# Altium schematic sheet Peripherals.SchDoc: Sensors & Peripherals Interfaces
size A2; SheetNumber: 3; SheetTotal: 5
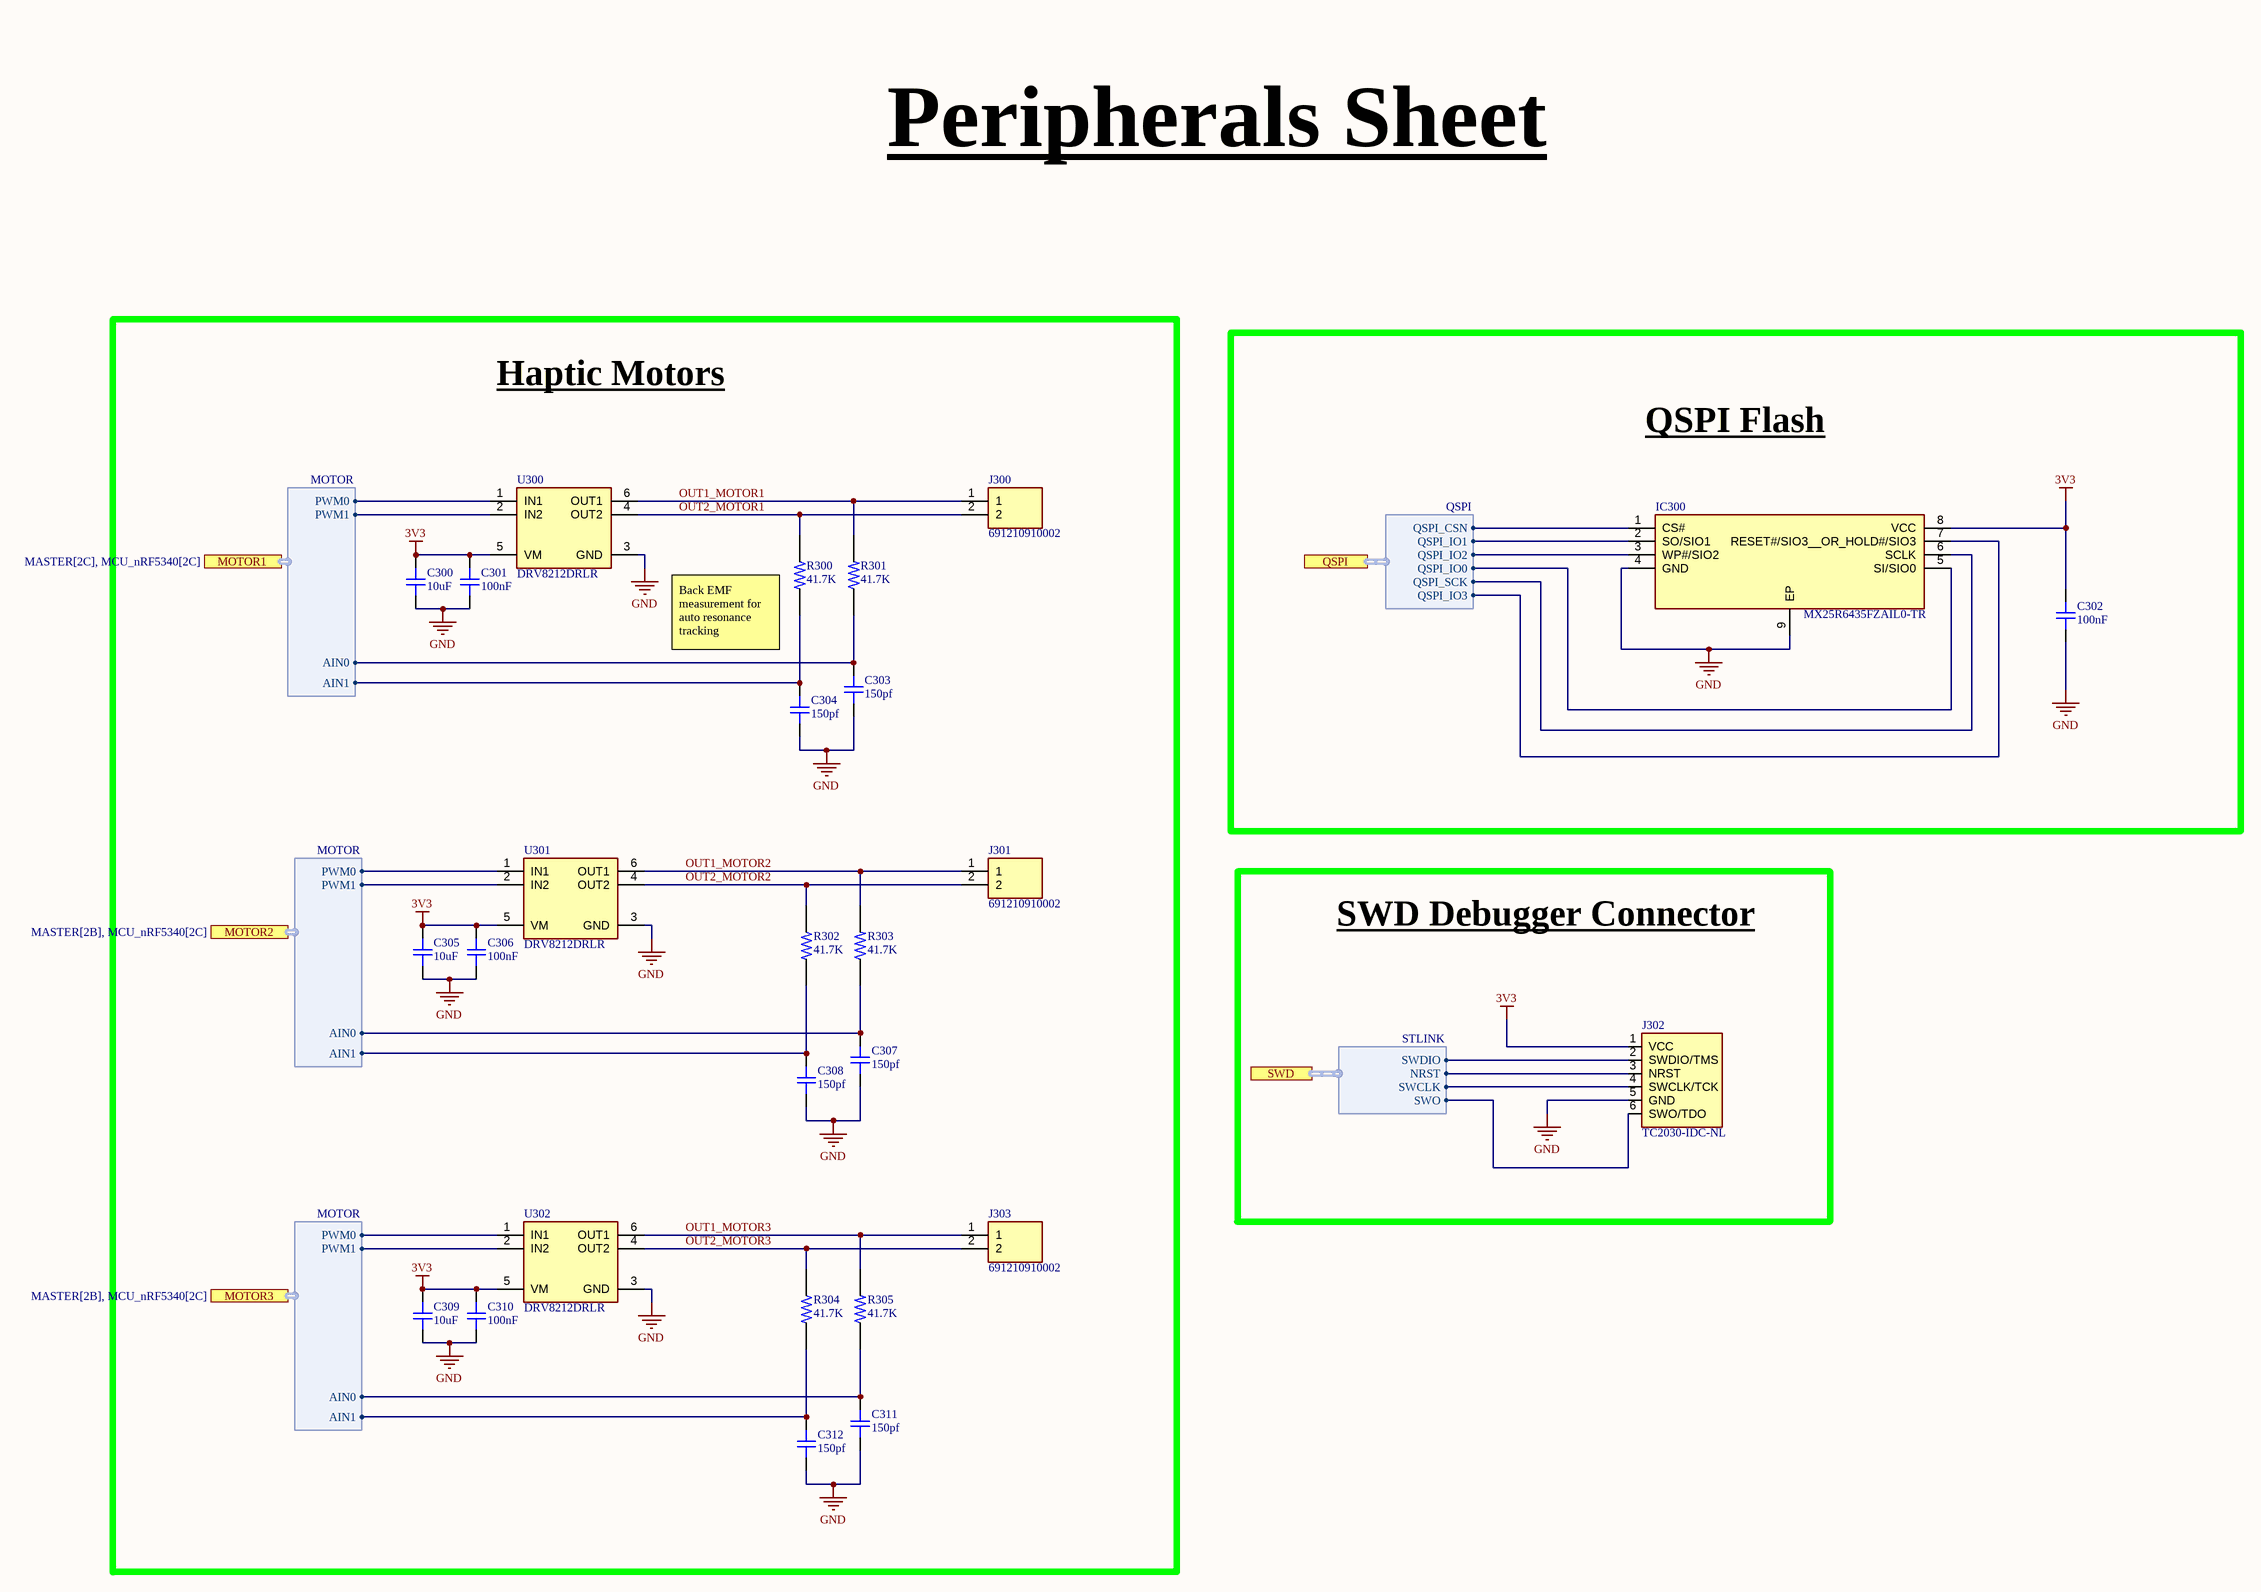
[diagram p0: Peripherals.SchDoc]

## Parts
C300  10uF  [CAP_0603]
C301  100nF  [CAP_0603]
C302  100nF  [CAP_0603]
C303  150pf  [CAP_0603]
C304  150pf  [CAP_0603]
C305  10uF  [CAP_0603]
C306  100nF  [CAP_0603]
C307  150pf  [CAP_0603]
C308  150pf  [CAP_0603]
C309  10uF  [CAP_0603]
C310  100nF  [CAP_0603]
C311  150pf  [CAP_0603]
C312  150pf  [CAP_0603]
IC300  MX25R6435FZAIL0-TR  [SON80P400X400X60-9N]
J300  691210910002  [691210910002]
J301  691210910002  [691210910002]
J302  TC2030-IDC-NL  [TC2030IDC]
J303  691210910002  [691210910002]
R300  41.7K  [RESC1607X60N]
R301  41.7K  [RESC1607X60N]
R302  41.7K  [RESC1607X60N]
R303  41.7K  [RESC1607X60N]
R304  41.7K  [RESC1607X60N]
R305  41.7K  [RESC1607X60N]
U300  DRV8212DRLR  [SOTFL50P160X60-6N]
U301  DRV8212DRLR  [SOTFL50P160X60-6N]
U302  DRV8212DRLR  [SOTFL50P160X60-6N]

## Blocks framed on the sheet
Haptic Motors: C300 C301 C303-C312 J300 J301 J303 R300-R305 U300-U302
QSPI Flash: C302 IC300
SWD Debugger Connector: J302

## Ports
MOTOR1 (harness MOTOR, see MASTER[2C], MCU_nRF5340[2C]), MOTOR2 (harness MOTOR, see MASTER[2B], MCU_nRF5340[2C]), MOTOR3 (harness MOTOR, see MASTER[2B], MCU_nRF5340[2C]), QSPI (harness QSPI), SWD (harness STLINK)

## Harnesses
STLINK: NRST, SWDIO, SWCLK, SWO
QSPI: QSPI_SCK, QSPI_IO0, QSPI_IO1, QSPI_IO2, QSPI_IO3, QSPI_CSN
MOTOR: PWM1, PWM0, AIN0, AIN1

## Nets
3V3: C300.2 C301.2 C302.2 C305.2 C306.2 C309.2 C310.2 IC300.8(VCC) J302.1(VCC) U300.5(VM) U301.5(VM) U302.5(VM)
GND: C300.1 C301.1 C302.1 C303.1 C304.1 C305.1 C306.1 C307.1 C308.1 C309.1 C310.1 C311.1 C312.1 IC300.4(GND) IC300.9(EP) J302.5(GND) U300.3(GND) U301.3(GND) U302.3(GND)
OUT1_MOTOR1: J300.1 R301.2 U300.6(OUT1)
OUT1_MOTOR2: J301.1 R303.2 U301.6(OUT1)
OUT1_MOTOR3: J303.1 R305.2 U302.6(OUT1)
OUT2_MOTOR1: J300.2 R300.1 U300.4(OUT2)
OUT2_MOTOR2: J301.2 R302.1 U301.4(OUT2)
OUT2_MOTOR3: J303.2 R304.1 U302.4(OUT2)
NetC303_2: C303.2 R301.1 ; port MOTOR1.AIN0
NetC304_2: C304.2 R300.2 ; port MOTOR1.AIN1
NetC307_2: C307.2 R303.1 ; port MOTOR2.AIN0
NetC308_2: C308.2 R302.2 ; port MOTOR2.AIN1
NetC311_2: C311.2 R305.1 ; port MOTOR3.AIN0
NetC312_2: C312.2 R304.2 ; port MOTOR3.AIN1
NetIC300_1: IC300.1(CS#) ; port QSPI.QSPI_CSN
NetIC300_2: IC300.2(SO/SIO1) ; port QSPI.QSPI_IO1
NetIC300_3: IC300.3(WP#/SIO2) ; port QSPI.QSPI_IO2
NetIC300_5: IC300.5(SI/SIO0) ; port QSPI.QSPI_IO0
NetIC300_6: IC300.6(SCLK) ; port QSPI.QSPI_SCK
NetIC300_7: IC300.7(RESET#/SIO3__OR_HOLD#/SIO3) ; port QSPI.QSPI_IO3
NetJ302_2: J302.2(SWDIO/TMS) ; port SWD.SWDIO
NetJ302_3: J302.3(NRST) ; port SWD.NRST
NetJ302_4: J302.4(SWCLK/TCK) ; port SWD.SWCLK
NetJ302_6: J302.6(SWO/TDO) ; port SWD.SWO
NetU300_1: U300.1(IN1) ; port MOTOR1.PWM0
NetU300_2: U300.2(IN2) ; port MOTOR1.PWM1
NetU301_1: U301.1(IN1) ; port MOTOR2.PWM0
NetU301_2: U301.2(IN2) ; port MOTOR2.PWM1
NetU302_1: U302.1(IN1) ; port MOTOR3.PWM0
NetU302_2: U302.2(IN2) ; port MOTOR3.PWM1

## Notes on the sheet
- Peripherals Sheet
- (near R300) Back EMF measurement for auto resonance tracking
- DWG. NO.
- REV.
- SHT.
- REVISION
- DESCRIPTION
- DATE
- APPROVED
- THIS DOCUMENT AND THE DATA DISCLOSED HEREIN OR HEREWITH IS THE PROPERTY OF ALTIUM LIMITED AND MAY BE FREELY DISTRIBUTED IN WHOLE. NO RIGHTS ARE RESERVED OR EXPRESS OR IMPLIED WARANTEE GIVEN.
- ENG:
- DSN:
- APPROVALS
- PROJECT
- DOCUMENT REVISION:
- DESIGN ITEM:
- CHK:
- BOM:
- REFERENCE DOCUMENTS
- PROJECT REVISION:
- TITLE
- FAB DWG:
- PCB DWG:
- ASSY DWG:
- SCALE:
- SIZE
- C
- CAGE CODE
- FILE NAME
- DWG NO.
- SHEET
- OF
- REV

## Library data of the parts
C300 C303-C305 C307-C309 C311 C312 = CAP_0603: Ceramic Capacitor, Multilayer, Ceramic, 4V, 20% +Tol, 20% -Tol, X6S, 22% TC, 10uF, Surface Mount, 1608M/0603; Value: 10µF; Manufacturer: *; Manufacturer Part Number: *; Distributor Link: *; LCSC: *; Rating: *; Dielectric: *; Supplier: Mouser; Supplier Part Number: 81-GXT188C80G106ME3D; RoHS: Compliant; Category: Ceramic Capacitors; Stock: 3027; Pricing: 1=0.31, 10=0.202, 50=0.202, 100=0.115, 1000=0.082, 10000=0.063 (USD); Case/Package: 0603; Dielectric Material: Ceramic; Height: 800µm; Length: 1.6mm; Lifecycle Status: Production; Material: Ceramic; Max Operating Temperature: 105°C; Min Operating Temperature: -55°C; Mounting Technology: Surface Mount; Number of Terminals: 2; REACH SVHC: Yes; Tolerance: 20%; Voltage Rating: 4V; Voltage Rating (DC): 4V; Width: 800µm; ComponentLink1URL: http://sigma.octopart.com:80/reach_statement/Murata-company-16.pdf?src-supplier=Compliance+Statements; ComponentLink1Description: http://sigma.octopart.com:80/reach_statement/Murata-company-16.pdf?src-supplier=Compliance+Statements
C301 C302 C306 C310 = CAP_0603: Capacitor SMD 0603; Manufacturer: *; Manufacturer Part Number: *; Distributor Link: *; LCSC: *; Rating: *; Dielectric: *
IC300 = MX25R6435FZAIL0-TR: Integrated Circuit; Manufacturer_Name: Macronix; Datasheet Link: https://www.mouser.com/datasheet/2/819/MX25R6435F_2c_Wide_Range_2c_64Mb_2c_v1_6-3370962.pdf; Height: 0.6mm; Manufacturer_Part_Number: MX25R6435FZAIL0-TR; Mouser Part Number: 95-25R6435FZAIL0TR; Mouser Price/Stock: https://www.mouser.co.uk/ProductDetail/Macronix/MX25R6435FZAIL0-TR?qs=mELouGlnn3cK%252BXKdc9RzBg%3D%3D
J300 J301 J303 = 691210910002: WR-TBL Terminal block - Rising Cage - THT Serie 2109 - 2,54mm pitch - Monoblock THT - Green - Horizontal cable entry Rising Cage Clamp 8.5mm height - 02p; Manufacturer_Name: Wurth Elektronik; Geometry.Height: 8.8mm; Mouser Part Number: 710-691210910002; Mouser Price/Stock: https://www.mouser.co.uk/ProductDetail/Wurth-Elektronik/691210910002?qs=sPbYRqrBIVlpmUgpxfjjUA%3D%3D; Manufacturer_Part_Number: 691210910002; Datasheet Link: https://www.we-online.com/catalog/datasheet/691210910002.pdf
J302 = TC2030-IDC-NL: CABLE ADAPTER 6 POS; Value: *; MP: TC2030-IDC-NL; Availability: Unavailable; Package: None; Price: None
R300-R305 = RC0603JR0710KL: Res Thin Film 0402 41.7K Ohm 0.1% 1/16W 25ppm/C Molded SMD SMD Paper T/R; Manufacturer: Vishay; Manufacturer Part Number: TNPW040241K7BEED; MF: Yageo; Max Power Dissipation: 63mW; Temperature Coefficient: 25ppm/°C; Working Voltage: 50V; SnapEDA_Link: https://www.snapeda.com/parts/RC0603JR0710KL/Yageo/view-part/?ref=snap; Package: 0603 Yageo; Value: *; MP: RC0603JR0710KL; Check_prices: https://www.snapeda.com/parts/RC0603JR0710KL/Yageo/view-part/?ref=eda; Supplier: Farnell; Supplier Part Number: 3975618RL; RoHS: Compliant; Category: Chip SMD Resistors; Stock: 4910; Pricing: 100=0.15, 500=0.128, 2500=0.127, 5000=0.118, 10000=0.0988 (EUR); Case/Package: 0402; China RoHS: Compliant; Composition: Thin Film; Contact Plating: Tin; Features: Anti-Sulfur, Automotive AEC-Q200, Moisture Resistant; Height: 350µm; Length: 990.6µm; Lifecycle Status: Production; Max Operating Temperature: 125°C; Min Operating Temperature: -55°C; Mounting Technology: Surface Mount; Number of Terminals: 2; Number of Terminations: 2; Power Dissipation: 63mW; Power Rating: 63mW; REACH SVHC: Yes; Tolerance: 0.1%; Width: 500µm; ComponentLink1URL: https://datasheet.octopart.com:443/TNPW040241K7BEED-Vishay-datasheet-182188515.pdf?src-supplier=IHS; ComponentLink1Description: https://datasheet.octopart.com:443/TNPW040241K7BEED-Vishay-datasheet-182188515.pdf?src-supplier=IHS; ComponentLink2URL: https://datasheet.octopart.com:443/TNPW040241K7BEED-Vishay-Dale-datasheet-182026744.pdf?src-supplier=IHS; ComponentLink2Description: https://datasheet.octopart.com:443/TNPW040241K7BEED-Vishay-Dale-datasheet-182026744.pdf?src-supplier=IHS; ComponentLink3URL: https://datasheet.octopart.com/TNPW040241K7BEED-Vishay-datasheet-13498837.pdf; ComponentLink3Description: https://datasheet.octopart.com/TNPW040241K7BEED-Vishay-datasheet-13498837.pdf; ComponentLink4URL: https://datasheet.octopart.com/TNPW040241K7BEED-Vishay-datasheet-13414878.pdf; ComponentLink4Description: https://datasheet.octopart.com/TNPW040241K7BEED-Vishay-datasheet-13414878.pdf; ComponentLink5URL: https://datasheet.octopart.com/TNPW040241K7BEED-Vishay-datasheet-13295955.pdf; ComponentLink5Description: https://datasheet.octopart.com/TNPW040241K7BEED-Vishay-datasheet-13295955.pdf; ComponentLink6URL: https://datasheet.octopart.com/TNPW040241K7BEED-Vishay-datasheet-13196373.pdf; ComponentLink6Description: https://datasheet.octopart.com/TNPW040241K7BEED-Vishay-datasheet-13196373.pdf; ComponentLink7URL: https://datasheet.octopart.com/TNPW040241K7BEED-Vishay-datasheet-13143890.pdf; ComponentLink7Description: https://datasheet.octopart.com/TNPW040241K7BEED-Vishay-datasheet-13143890.pdf; ComponentLink8URL: https://datasheet.octopart.com/TNPW040241K7BEED-Vishay-datasheet-13081780.pdf; ComponentLink8Description: https://datasheet.octopart.com/TNPW040241K7BEED-Vishay-datasheet-13081780.pdf; ComponentLink9URL: https://datasheet.octopart.com/TNPW040241K7BEED-Vishay-datasheet-13052401.pdf; ComponentLink9Description: https://datasheet.octopart.com/TNPW040241K7BEED-Vishay-datasheet-13052401.pdf; ComponentLink10URL: https://datasheet.octopart.com/TNPW040241K7BEED-Vishay-datasheet-13034137.pdf; ComponentLink10Description: https://datasheet.octopart.com/TNPW040241K7BEED-Vishay-datasheet-13034137.pdf; ComponentLink11URL: https://datasheet.octopart.com/TNPW040241K7BEED-Vishay-datasheet-12585086.pdf; ComponentLink11Description: https://datasheet.octopart.com/TNPW040241K7BEED-Vishay-datasheet-12585086.pdf; ComponentLink12URL: https://datasheet.octopart.com/TNPW040241K7BEED-Vishay-datasheet-12543131.pdf; ComponentLink12Description: https://datasheet.octopart.com/TNPW040241K7BEED-Vishay-datasheet-12543131.pdf; ComponentLink13URL: https://datasheet.octopart.com/TNPW040241K7BEED-Vishay-datasheet-12532511.pdf; ComponentLink13Description: https://datasheet.octopart.com/TNPW040241K7BEED-Vishay-datasheet-12532511.pdf; ComponentLink14URL: https://datasheet.octopart.com/TNPW040241K7BEED-Vishay-datasheet-12519971.pdf; ComponentLink14Description: https://datasheet.octopart.com/TNPW040241K7BEED-Vishay-datasheet-12519971.pdf; ComponentLink15URL: https://datasheet.octopart.com/TNPW040241K7BEED-Vishay-datasheet-12509767.pdf; ComponentLink15Description: https://datasheet.octopart.com/TNPW040241K7BEED-Vishay-datasheet-12509767.pdf; ComponentLink16URL: https://datasheet.octopart.com/TNPW040241K7BEED-Vishay-datasheet-12365287.pdf; ComponentLink16Description: https://datasheet.octopart.com/TNPW040241K7BEED-Vishay-datasheet-12365287.pdf; ComponentLink17URL: https://datasheet.octopart.com/TNPW040241K7BEED-Vishay-datasheet-10854096.pdf; ComponentLink17Description: https://datasheet.octopart.com/TNPW040241K7BEED-Vishay-datasheet-10854096.pdf; ComponentLink18URL: https://datasheet.octopart.com/TNPW040241K7BEED-Vishay-datasheet-10678752.pdf; ComponentLink18Description: https://datasheet.octopart.com/TNPW040241K7BEED-Vishay-datasheet-10678752.pdf; ComponentLink19URL: https://datasheet.octopart.com/TNPW040241K7BEED-Vishay-datasheet-10283461.pdf; ComponentLink19Description: https://datasheet.octopart.com/TNPW040241K7BEED-Vishay-datasheet-10283461.pdf; ComponentLink20URL: https://datasheet.octopart.com/TNPW040241K7BEED-Vishay-datasheet-10185418.pdf; ComponentLink20Description: https://datasheet.octopart.com/TNPW040241K7BEED-Vishay-datasheet-10185418.pdf; ComponentLink21URL: https://datasheet.octopart.com/TNPW040241K7BEED-Vishay-datasheet-10055244.pdf; ComponentLink21Description: https://datasheet.octopart.com/TNPW040241K7BEED-Vishay-datasheet-10055244.pdf; ComponentLink22URL: http://sigma.octopart.com:80/rohs_statement/Vishay-company-15.pdf?src-supplier=Compliance+Statements; ComponentLink22Description: http://sigma.octopart.com:80/rohs_statement/Vishay-company-15.pdf?src-supplier=Compliance+Statements
U300-U302 = DRV8212DRLR: Motor / Motion / Ignition Controllers & Drivers 12-V, 2-A Low voltage H-bridge motor driver; Manufacturer_Name: Texas Instruments; Geometry.Height: 0.6mm; Mouser Part Number: 595-DRV8212DRLR; Mouser Price/Stock: https://www.mouser.co.uk/ProductDetail/Texas-Instruments/DRV8212DRLR?qs=7D1LtPJG0i3wtDTC%2FUQdKg%3D%3D; Manufacturer_Part_Number: DRV8212DRLR; Datasheet Link: https://www.ti.com/lit/ds/symlink/drv8212.pdf?ts=1631761675954&ref_url=https%253A%252F%252Fwww.ti.com%252Fstore%252Fti%252Fen%252Fp%252Fproduct%252F%253Fp%253DDRV8212DRLR%2526keyMatch%253DDRV8212DRLR%2526tisearch%253Dsearch-everything%2526usecase%253DOPN